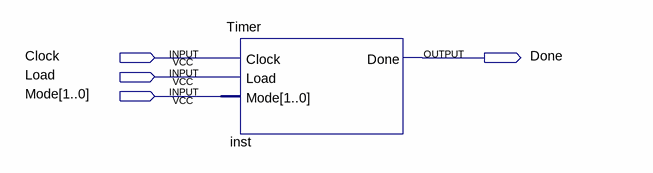
[diagram p0: schematic sheet]
// Quartus schematic timerTest.bdf as structural Verilog: 1 symbols, 4 pins
module timerTest (
  input  Clock,
  input  Load,
  input  [1:0] Mode,
  output Done
);

  Timer inst (.Clock(Clock), .Load(Load), .Mode(Mode), .Done(Done));
endmodule
